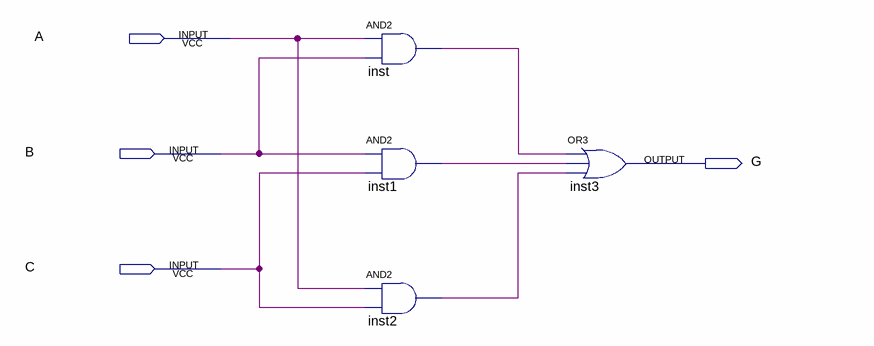
[diagram p0: schematic sheet]
// Quartus schematic Block2.bdf as structural Verilog: 4 symbols, 4 pins
module Block2 (
  input  A,
  input  B,
  input  C,
  output G
);

  wire inst1_out, inst2_out, inst_out;

  and inst (inst_out, A, B);
  and inst1 (inst1_out, B, C);
  and inst2 (inst2_out, A, C);
  or inst3 (G, inst_out, inst1_out, inst2_out);
endmodule
